# EAGLE design Mozard 2020-10-18 (EAGLE 9.6.2)
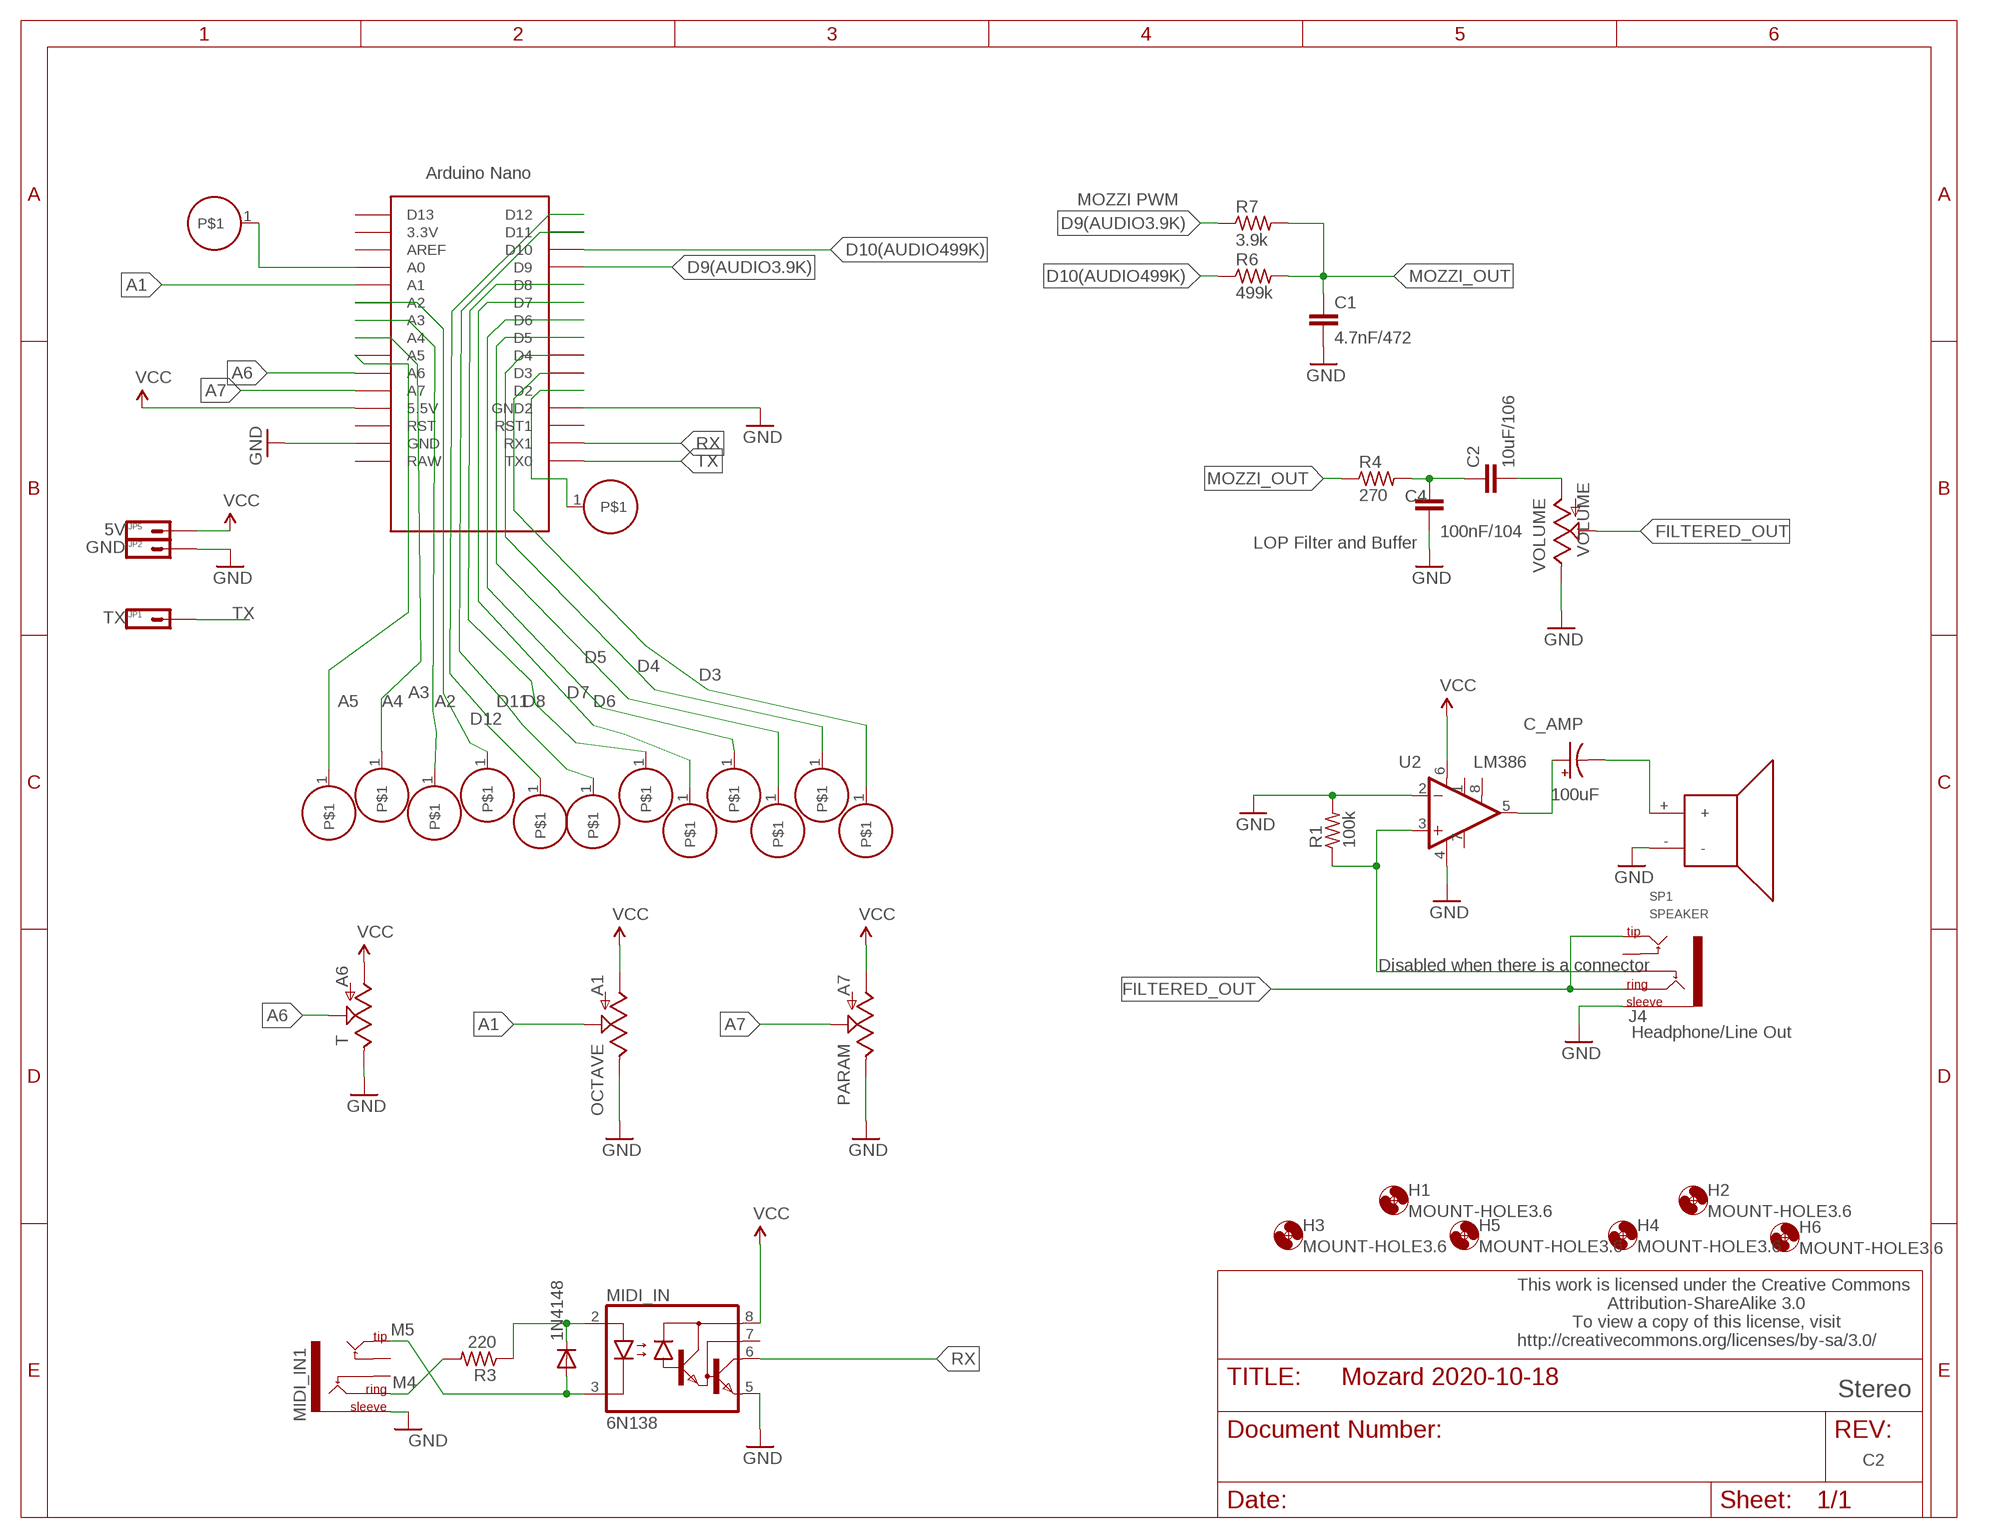
[diagram p0: schematic, sheet 1]

## Parts
1N4148  1N4148  DIODE  [DO41-10]
C1  4.7nF/472  0.1UF-50V-20%(PTH)KIT-EZ  [CAP-PTH-SMALL-KIT]
C2  10uF/106  0.1UF-50V-20%(PTH)KIT-EZ  [CAP-PTH-SMALL-KIT]
C4  100nF/104  0.1UF-50V-20%(PTH)KIT-EZ  [CAP-PTH-SMALL-KIT]
C_AMP  100uF  CPOL-RADIAL-10UF-25V  [CPOL-RADIAL-10UF-25V]
H1  MOUNT-HOLE3.6  [3,6]
H2  MOUNT-HOLE3.6  [3,6]
H3  MOUNT-HOLE3.6  [3,6]
H4  MOUNT-HOLE3.6  [3,6]
H5  MOUNT-HOLE3.6  [3,6]
H6  MOUNT-HOLE3.6  [3,6]
J4  Headphone/Line Out  AUDIO-JACKPTH  [AUDIO-JACK]
JP1  TX  HEADER-1X1  [1X01_SIDE_NAME]
JP2  GND  HEADER-1X1  [1X01_SIDE_NAME]
JP5  5V  HEADER-1X1  [1X01_SIDE_NAME]
MIDI_IN  6N138  [DIL08]
MIDI_IN1  AUDIO-JACKKIT  [AUDIO-JACK-KIT]
OCTAVE  A1  POT  [ALPS_POT]
PARAM  A7  POT  [ALPS_POT]
R1  100k  R-US_0204/7  [0204/7]
R3  220  R-US_0204/5  [0204/5]
R4  270  R-US_0204/7  [0204/7]
R6  499k  R-US_0204/7  [0204/7]
R7  3.9k  R-US_0204/7  [0204/7]
SP1  SPEAKER  SPEAKERPCB_MOUNT  [PCB_MOUNT_SPEAKER]
T  A6  POT  [ALPS_POT]
U2  LM386  [DIP08]
U$1  NANO  [NANO]
U$2  PCB-TOUCHPAD-1-PIN  [PCB-TOUCHPAD-1-PIN]
U$3  PCB-TOUCHPAD-1-PIN  [PCB-TOUCHPAD-1-PIN]
U$4  PCB-TOUCHPAD-1-PIN  [PCB-TOUCHPAD-1-PIN]
U$5  PCB-TOUCHPAD-1-PIN  [PCB-TOUCHPAD-1-PIN]
U$6  PCB-TOUCHPAD-1-PIN  [PCB-TOUCHPAD-1-PIN]
U$7  PCB-TOUCHPAD-1-PIN  [PCB-TOUCHPAD-1-PIN]
U$8  PCB-TOUCHPAD-1-PIN  [PCB-TOUCHPAD-1-PIN]
U$9  PCB-TOUCHPAD-1-PIN  [PCB-TOUCHPAD-1-PIN]
U$10  PCB-TOUCHPAD-1-PIN  [PCB-TOUCHPAD-1-PIN]
U$11  PCB-TOUCHPAD-1-PIN  [PCB-TOUCHPAD-1-PIN]
U$12  PCB-TOUCHPAD-1-PIN  [PCB-TOUCHPAD-1-PIN]
U$13  PCB-TOUCHPAD-1-PIN  [PCB-TOUCHPAD-1-PIN]
U$14  PCB-TOUCHPAD-1-PIN  [PCB-TOUCHPAD-1-PIN]
U$15  PCB-TOUCHPAD-1-PIN  [PCB-TOUCHPAD-1-PIN]
VOLUME  VOLUME  POT  [ALPS_POT]

## Nets
A1: OCTAVE.P$2(S) U$1.A1
A2: U$1.A2 U$5.1
A3: U$1.A3 U$4.1
A4: U$1.A4 U$3.1
A5: U$1.A5 U$2.1
A6: T.P$2(S) U$1.A6
A7: PARAM.P$2(S) U$1.A7
D3: U$1.D3 U$13.1
D4: U$1.D4 U$12.1
D5: U$1.D5 U$11.1
D6: U$1.D6 U$10.1
D7: U$1.D7 U$9.1
D8: U$1.D8 U$8.1
D9(AUDIO3.9K): R7.1 U$1.D9
D10(AUDIO499K): R6.1 U$1.D10
D11: U$1.D11 U$7.1
D12: U$1.D12 U$6.1
FILTERED_OUT: J4.RING J4.TIP VOLUME.P$2(S)
GND: C1.2 C4.2 J4.SLEEVE JP2.1 MIDI_IN1.SLEEVE MIDI_IN.5(GND) OCTAVE.P$1(E) PARAM.P$1(E) R1.2 SP1.- T.P$1(E) U2.2(-IN) U2.4(V-) U$1.GND U$1.GND1(GND2) VOLUME.P$1(E)
M4: MIDI_IN1.RING R3.2
M5: 1N4148.A MIDI_IN1.TIP MIDI_IN.3(C)
MOZZI_OUT: C1.1 R4.1 R6.2 R7.2
N$1: C_AMP.+ U2.5(OUT)
N$2: C2.2 VOLUME.P$3(A)
N$3: U$1.A0 U$15.1
N$4: C2.1 C4.1 R4.2
N$5: C_AMP.- SP1.+
N$6: J4.RSH R1.1 U2.3(+IN)
N$10: 1N4148.C MIDI_IN.2(A) R3.1
RX: MIDI_IN.6(VO) U$1.RX1
TOUCH_A: U$1.D2 U$14.1
TX: JP1.1 U$1.TX0
VCC: JP5.1 MIDI_IN.8(VCC) OCTAVE.P$3(A) PARAM.P$3(A) T.P$3(A) U2.6(V+) U$1.5V(5.5V)
Unconnected: J4.TSH MIDI_IN1.RSH MIDI_IN1.TSH MIDI_IN.7(VB) U2.1(GAIN) U2.7(BP) U2.8(GAIN) U$1.3.3V U$1.AREF U$1.D13 U$1.RAW U$1.RST U$1.RST1

## Notes on the sheet
- MOZZI PWM
- LOP Filter and Buffer
- Disabled when there is a connector
- This work is licensed under the Creative Commons
                    Attribution-ShareAlike 3.0
             To view a copy of this license, visit
  http://creativecommons.org/licenses/by-sa/3.0/
- Stereo
- C2

## Library data of the parts
1N4148 = TOF:DIODE: DIODE general purpose rectifier, 1 A
C1 C2 C4 = SparkFun-Capacitors:0.1UF-50V-20%(PTH): CAP-08370; PROD_ID: CAP-08370
C_AMP = Mitch-parts:CPOL-RADIAL-10UF-25V: Electrolytic Polarized
H1-H6 = holes:MOUNT-HOLE: MOUNTING HOLE with drill center marker
J4 MIDI_IN1 = TOF:AUDIO-JACK: Stereo audio jack with bypass switches. SMT version used on LilyPad MP3 board.; PROD_ID: CONN-08774
JP1 JP2 JP5 = TOF:HEADER-1X1: Header 1 Standard 1-pin 0.1" header. Use with straight break away headers (SKU : PRT-00116), right angle break away headers (PRT-00553), swiss pins (PRT-00743), machine pins (PRT-00117), and female headers (PRT-00115).
MIDI_IN = TOF:6N138: MOTOROLA OPTO COUPLER; MF: VISHAY/TELEFUNKEN; MPN: 6N138; OC_FARNELL: 9860150; OC_NEWARK: 35K5294
OCTAVE PARAM T VOLUME = TOF:POT
R1 R3 R4 R6 R7 = adafruit:R-US_: RESISTOR, American symbol
SP1 = SparkFun-Electromechanical:SPEAKER: General speakers.; MFG: SANCO; PROD_#: NA; SKU: COM-11089; SPARKLE_ID: 6504
U2 = Mitch-parts:LM386: low voltage audio power amplifier
U$1 = TOF:NANO: Arduino Nano
U$2-U$15 = TOF:PCB-TOUCHPAD-1-PIN

## Board
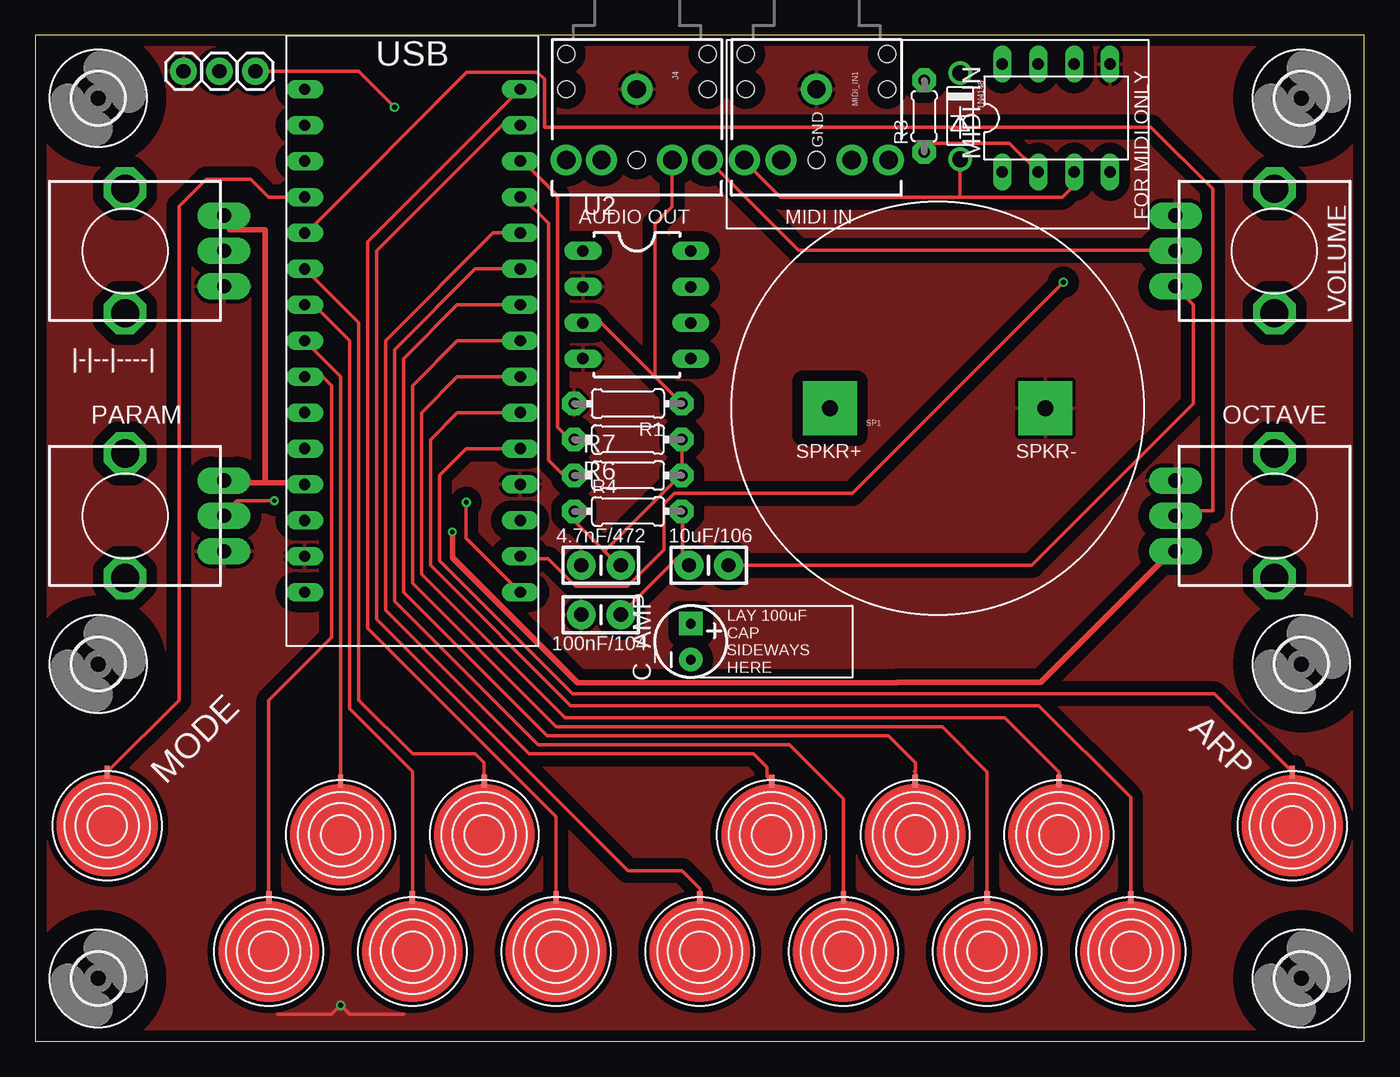
[diagram p1: board, top side]
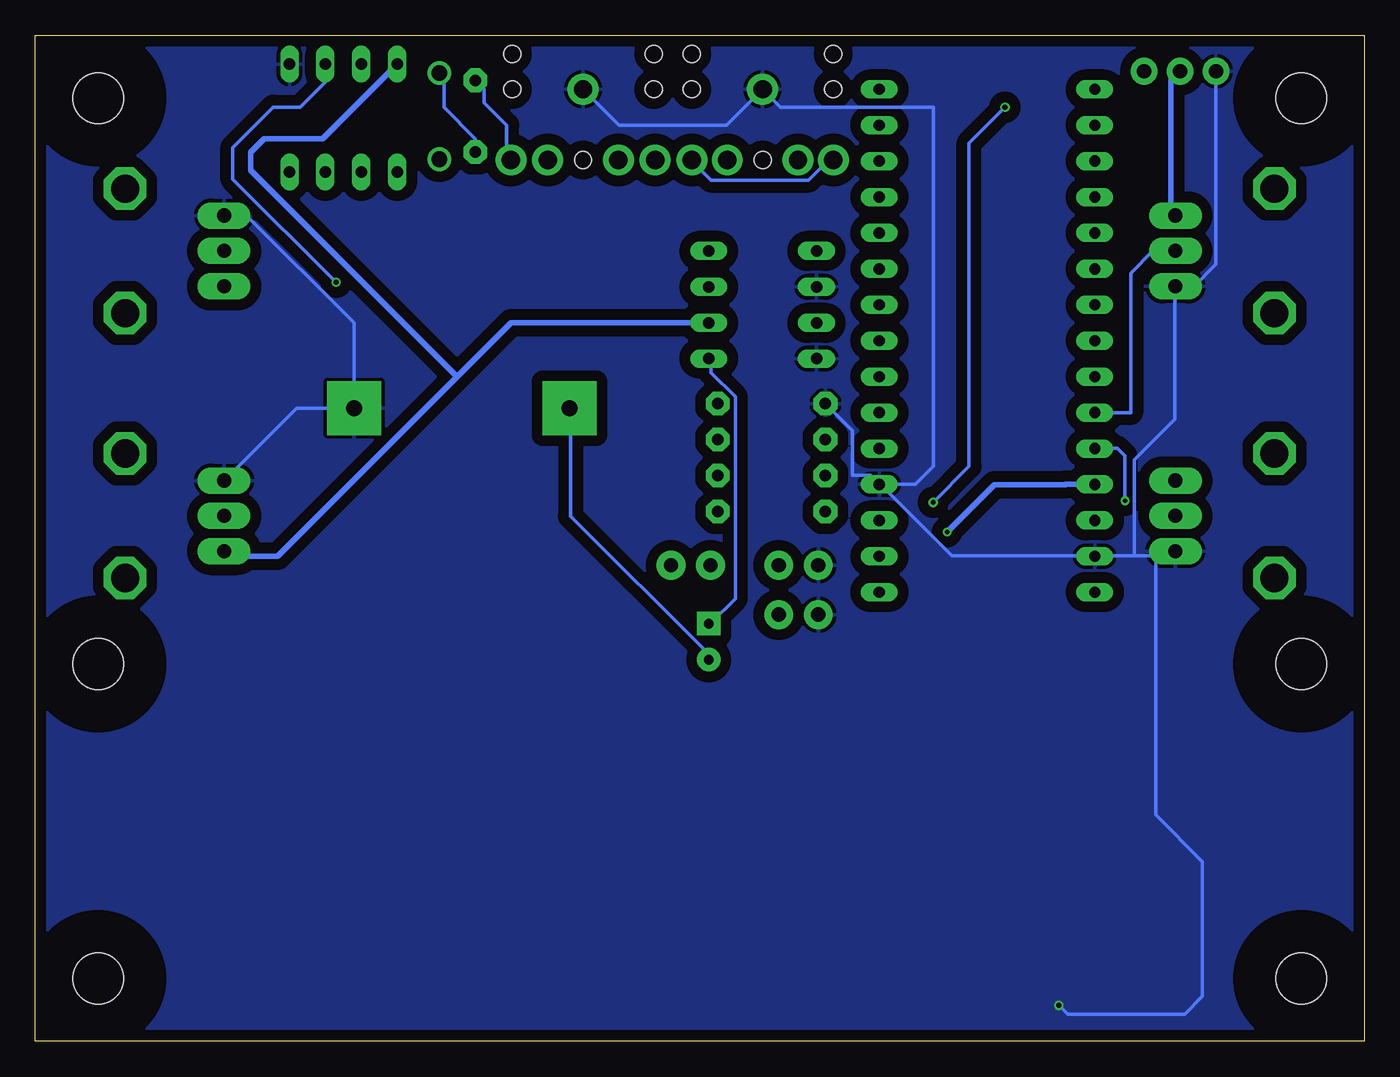
[diagram p2: board, bottom side, seen from below]

Size 93.98 x 71.12 mm. Coordinates in mm from the lower left corner, seen from the top.
Outline: 0,0 93.98,0 93.98,71.12 0,71.12 0,0
Copper layers (1*16): Top 0.035mm / dielectric 1.5mm / Bottom 0.035mm
Design rules "EagleRules *": minimum track width 10mil, minimum drill 12mil, track to track 7mil, track to pad 7mil, pad to pad 7mil, via to via 7mil, smd to smd 0mil, copper to edge 20mil, drill to drill 10mil, minimum pad ring 10mil, minimum via ring 6mil, stop-mask expansion 2mil, vias tented up to drill 25mil, thermal gap 10mil

### Footprints (pad centres in the part's own frame; a part is rotated, then mirrored left to right if it is on the bottom)
DO41-10 = drill 1.118: A 3.048,0; C -3.048,0
CAP-PTH-SMALL-KIT = drill 1.016 pad 2.032: 1 -1.397,0; 2 1.397,0
CPOL-RADIAL-10UF-25V = drill 0.7 pad 1.651 square: + 1.27,0 | drill 0.7 pad 1.651: - -1.27,0
3,6 = hole 3.6: 0,0
AUDIO-JACK = drill 1.3 pad 2.184: RING 5,5; RSH 5,2.5; SLEEVE 0,0; TIP 5,-5; TSH 5,-2.5 | hole 1.2: 0,5; -2.5,5; -2.5,-5; 0,-5; 5,0
1X01_SIDE_NAME = drill 1.016 pad 1.88: 1 0,0
DIL08 = drill 0.813 long: 1 -3.81,-3.81; 2 -1.27,-3.81; 3 1.27,-3.81; 4 3.81,-3.81; 5 3.81,3.81; 6 1.27,3.81; 7 -1.27,3.81; 8 -3.81,3.81
AUDIO-JACK-KIT = drill 1.3 pad 2.184: RING 5,5.1; RSH 5,2.5; SLEEVE 0,0; TIP 5,-5.1; TSH 5,-2.5 | hole 1.2: 0,5; -2.5,5; -2.5,-5; 0,-5; 5,0
ALPS_POT = drill 1 pad 1.88 long: P$1 7,-2.5; P$2 7,0; P$3 7,2.5 | drill 2 octagon: P$4 0,-4.4; P$5 0,4.4
0204/7 = drill 0.813 pad 1.676 octagon: 1 -3.81,0; 2 3.81,0
0204/5 = drill 0.813 pad 1.676 octagon: 1 -2.54,0; 2 2.54,0
PCB_MOUNT_SPEAKER = drill 1.143 pad 3.81 square: + -7.62,0; - 7.62,0
DIP08 = drill 0.813 long: 1 -3.81,-3.81; 2 -1.27,-3.81; 3 1.27,-3.81; 4 3.81,-3.81; 5 3.81,3.81; 6 1.27,3.81; 7 -1.27,3.81; 8 -3.81,3.81
NANO = drill 0.8 long: 3.3V -7.62,15.24; 5V -7.62,-10.16; A0 -7.62,10.16; A1 -7.62,7.62; A2 -7.62,5.08; A3 -7.62,2.54; A4 -7.62,0; A5 -7.62,-2.54; A6 -7.62,-5.08; A7 -7.62,-7.62; AREF -7.62,12.7; D2 7.62,-7.62; D3 7.62,-5.08; D4 7.62,-2.54; D5 7.62,0; D6 7.62,2.54; D7 7.62,5.08; D8 7.62,7.62; D9 7.62,10.16; D10 7.62,12.7; D11 7.62,15.24; D12 7.62,17.78; D13 -7.62,17.78; GND -7.62,-15.24; GND1 7.62,-10.16; RAW -7.62,-17.78; RST -7.62,-12.7; RST1 7.62,-12.7; RX1 7.62,-15.24; TX0 7.62,-17.78
PCB-TOUCHPAD-1-PIN = smd 0.889 x 0.381: 1 -3.81,0

### Placement (x,y rotation side)
1N4148  65.41,65.41 270 top
C1  40.01,33.66 180 top
C2  47.62,33.66 0 top
C4  40.01,30.16 180 top
C_AMP  46.35,28.26 90 top
H1  4.45,26.67 0 top
H2  4.45,66.67 0 top
H3  89.53,26.67 0 top
H4  89.53,66.67 0 top
H5  4.45,4.45 0 top
H6  89.53,4.45 0 top
J4  42.55,67.31 270 top
JP1  15.56,68.58 0 top
JP2  10.48,68.58 270 top
JP5  13.02,68.58 270 top
MIDI_IN  72.2,65.28 0 top
MIDI_IN1  55.24,67.31 270 top
OCTAVE  87.63,37.15 180 top
PARAM  6.35,37.15 0 top
R1  41.91,45.09 180 top
R3  62.87,65.41 90 top
R4  41.91,37.47 0 top
R6  41.91,42.55 0 top
R7  41.91,40.01 0 top
SP1  63.82,44.77 0 top
T  6.35,55.88 0 top
U2  42.55,52.07 270 top
U$1  26.67,49.53 0 top
U$2  16.51,6.35 270 top
U$3  21.59,14.61 270 top
U$4  26.67,6.35 270 top
U$5  31.75,14.61 270 top
U$6  36.83,6.35 270 top
U$7  46.99,6.35 270 top
U$8  52.07,14.61 270 top
U$9  57.15,6.35 270 top
U$10  62.23,14.61 270 top
U$11  67.31,6.35 270 top
U$12  72.39,14.61 270 top
U$13  77.47,6.35 270 top
U$14  88.9,15.24 270 top
U$15  5.08,15.24 270 top
VOLUME  87.63,55.88 180 top

### Tracks (layer width: path | path; a pad name or v marks a point on that pad's centre or on a via)
A1
  Top 0.254: U$1.A1 19.5,57.5 30.5,68.5 35.5,68.5 36,68 36,64.64 78.91,64.64 83.27,60.27 83.27,37.5 81,37.5 OCTAVE.P$2
A2
  Top 0.254: U$1.A2 22.86,50.8 22.86,24.13 26.67,20.32 31.11,20.32 31.75,19.68 U$5.1 31.75,18.47
A3
  Top 0.254: U$1.A3 19.68,52.07 22.23,49.53 22.23,23.5 26.67,19.05 U$4.1
A4
  Top 0.254: U$1.A4 21.59,46.99 U$3.1
A5
  Top 0.254: U$1.A5 20.32,46.99 20.95,46.35 20.95,28.57 16.51,24.13 U$2.1
A6
  Bottom 0.254: T.P$2 14.94,55.88 16.51,54.31 16.51,44.45 U$1.A6
A7  (via drill 0.3)
  Top 0.254: v16.92,38.21 14.25,38.21 13.39,37.35 PARAM.P$2
  Bottom 0.254: U$1.A7 19.02,41.94 17.46,41.94 16.92,41.39 v16.92,38.21
D3
  Top 0.254: U$1.D3 29.84,44.45 27.94,42.55 27.94,33.66 37.86,23.74 70.98,23.74 77.47,17.25 U$13.1
D4
  Top 0.254: U$1.D4 29.84,46.99 27.3,44.45 27.3,33.02 37.47,22.86 68.58,22.86 72.39,19.05 U$12.1 72.39,18.47 72.34,18.47
D5
  Top 0.254: U$1.D5 29.84,49.53 26.67,46.35 26.67,32.38 36.83,22.23 64.14,22.23 67.31,19.05 U$11.1
D6
  Top 0.254: U$1.D6 29.84,52.07 26.04,48.26 26.04,31.75 36.2,21.59 60.33,21.59 62.23,19.68 62.23,19.1 | 62.23,19.1 62.18,19.1 | U$10.1 62.23,19.1
D7
  Top 0.254: U$1.D7 31.11,54.61 25.4,48.9 25.4,31.11 35.56,20.95 53.34,20.95 57.15,17.14 U$9.1
D8
  Top 0.254: U$1.D8 32.38,57.15 24.77,49.53 24.77,30.48 34.92,20.32 50.8,20.32 51.75,19.37 51.75,18.73 U$8.1
D9(AUDIO3.9K)
  Top 0.254: R7.1 37.36,40.01 36.28,41.08 36.28,57.84 34.43,59.69 U$1.D9
D10(AUDIO499K)
  Top 0.254: U$1.D10 34.48,62.23 36.93,59.78 36.93,43.42 37.91,42.44 38,42.53 R6.1
D11
  Top 0.254: U$1.D11 33.02,64.77 24.13,55.88 24.13,29.84 41.91,12.06 45.72,12.06 46.99,10.79 U$7.1 | 46.94,10.21 46.99,10.21 U$7.1 | U$7.1 46.99,9.53
D12
  Top 0.254: U$1.D12 23.5,56.52 23.5,29.21 36.83,15.88 U$6.1
FILTERED_OUT
  Top 0.254: VOLUME.P$2 80.53,55.92 53.98,55.92 47.71,62.18 J4.RING
  Bottom 0.254: J4.TIP 37.57,62.18 38,62.18 39.29,60.88 46.2,60.88 47.5,62.18 J4.RING
GND  (via drill 0.35)
  Top 0.254: 17.14,1.91 20.95,1.91 v21.59,2.54 22.23,1.91 26.04,1.91
  Bottom 0.254: 14.73,34.33 13.6,34.33 13.39,34.54 PARAM.P$1 | 14.73,34.33 16.27,34.33 | 16.27,34.33 19,34.33 U$1.GND 19.21,34.33 29.15,34.33 34.11,39.29 U$1.GND1 | 13.39,53.33 13.39,43.99 16.27,41.11 16.27,34.33 | 13.39,53.33 T.P$1 | JP2.1 10.48,54.93 12.08,53.33 13.39,53.33 | 14.73,34.33 14.73,16 11.43,12.7 11.43,3.17 12.7,1.91 20.95,1.91 v21.59,2.54 | OCTAVE.P$1 75.51,44.77 SP1.- 71.44,50.8 79.02,58.38 VOLUME.P$1 | MIDI_IN1.SLEEVE 52.7,64.77 45.09,64.77 J4.SLEEVE 41.27,66.04 30.48,66.04 30.48,40.64 31.75,39.37 U$1.GND1 | U$1.GND1 34.92,40.01 36.2,40.01 36.2,43.18 R1.2
  pour Bottom (isolate 0.762): 0,71.12 93.98,71.12 93.98,0 0,0
  pour Top (isolate 0.762): 0,71.12 93.98,71.12 93.98,0 0,0
M4
  Bottom 0.254: R3.2 62.23,67.31 62.23,66.36 60.64,64.77 60.64,62.55 MIDI_IN1.RING
M5
  Top 0.254: MIDI_IN.3 73.47,60.52 72.64,59.69 65.41,59.69 | MIDI_IN1.TIP 50.16,62.23 52.7,59.69 65.41,59.69 | 65.41,59.69 1N4148.A
MOZZI_OUT
  Top 0.254: R6.2 R7.2 45.55,39.94 40.37,34.76 40.16,34.76 | 40.16,34.76 41.24,33.68 C1.1 | 40.16,34.76 38.21,36.7 38.21,37.35 R4.1
N$1
  Bottom 0.254: U2.5 46.2,48.15 46.2,47.28 44.48,45.55 44.48,31.3 46.2,29.58 C_AMP.+
N$2
  Top 0.254: C2.2 70.48,33.66 81.92,45.09 81.92,52.07 80.64,53.34 VOLUME.P$3
N$3
  Top 0.254: U$1.A0 16.51,59.69 15.24,60.96 12.06,60.96 10.16,59.05 10.16,24.13 U$15.1
N$4
  Top 0.254: 45.77,34.11 45.77,37.35 R4.2 | C2.1 45.77,34.11 | 45.77,34.11 45.34,34.11 41.45,30.23 C4.1
N$5
  Bottom 0.254: C_AMP.- 46.42,26.99 46.42,27.42 56.13,37.13 56.13,44.69 SP1.+
N$6
  Top 0.254: J4.RSH 45.05,59.02 43.81,57.78 43.81,46.99 | 43.81,46.99 R1.1 | U2.3 40.01,50.8 43.81,46.99
N$10
  Top 0.254: MIDI_IN.2 68.9,63.5 63.5,63.5 R3.1
  Bottom 0.254: R3.1 62.87,63.82 65.09,66.04 65.09,67.94 65.41,68.26 1N4148.C
RX  (via drill 0.35)
  Top 0.254: U$1.RX1 34.33,34.11 36.27,34.11 38.21,32.17 41.88,32.17 44.48,34.76 44.48,38 45.21,38.73 57.78,38.73 v72.71,53.66
  Bottom 0.254: v72.71,53.66 80.01,60.96 80.01,63.18 77.15,66.04 75.25,66.04 73.47,67.82 MIDI_IN.6
TOUCH_A
  Top 0.254: U$1.D2 30.48,41.91 28.57,40.01 28.57,33.97 37.99,24.56 83.39,24.56 U$14.1
TX  (via drill 0.35)
  Top 0.254: U$1.TX0 30.48,35.56 v30.48,38.1 | v25.4,66.04 22.86,68.58 JP1.1
  Bottom 0.254: v30.48,38.1 27.94,40.64 27.94,63.5 v25.4,66.04
VCC  (via drill 0.3)
  Top 0.254: 19,39.5 U$1.5V | 13.5,39.5 PARAM.P$3 | 80.01,34.29 OCTAVE.P$3 | 60.96,25.4 60.96,25.35
  Top 0.406: 13.5,39.5 16.27,39.5 | 16.27,39.5 19,39.5 | 16.27,39.5 16.27,57.37 13.75,57.37 T.P$3 | v29.5,36 29.5,34.18 38.33,25.35 60.96,25.35 | 80.01,34.29 71.12,25.4 60.96,25.4
  Bottom 0.254: 80.27,34.29 OCTAVE.P$3 | JP5.1 13.67,67.93
  Bottom 0.406: v29.5,36 26.14,39.37 21.14,39.37 21.13,39.37 U$1.5V | U2.6 60.33,50.8 64.14,46.99 | 64.14,46.99 76.83,34.29 80.27,34.29 | 13.67,67.93 13.67,58.7 T.P$3 | 64.14,46.99 78.74,61.59 78.74,62.87 77.79,63.82 73.66,63.82 MIDI_IN.8

### Text on the board
tPlace: GND | AUDIO OUT | MIDI IN | FOR MIDI ONLY | |-|--|----| | SPKR+ | SPKR- | LAY 100uF / CAP / SIDEWAYS / HERE | ARP | MODE
tValues: 1N4148
bValues: JLCJLCJLCJLC | MOZARD 2020-10-18 TOFSTUFF.COM